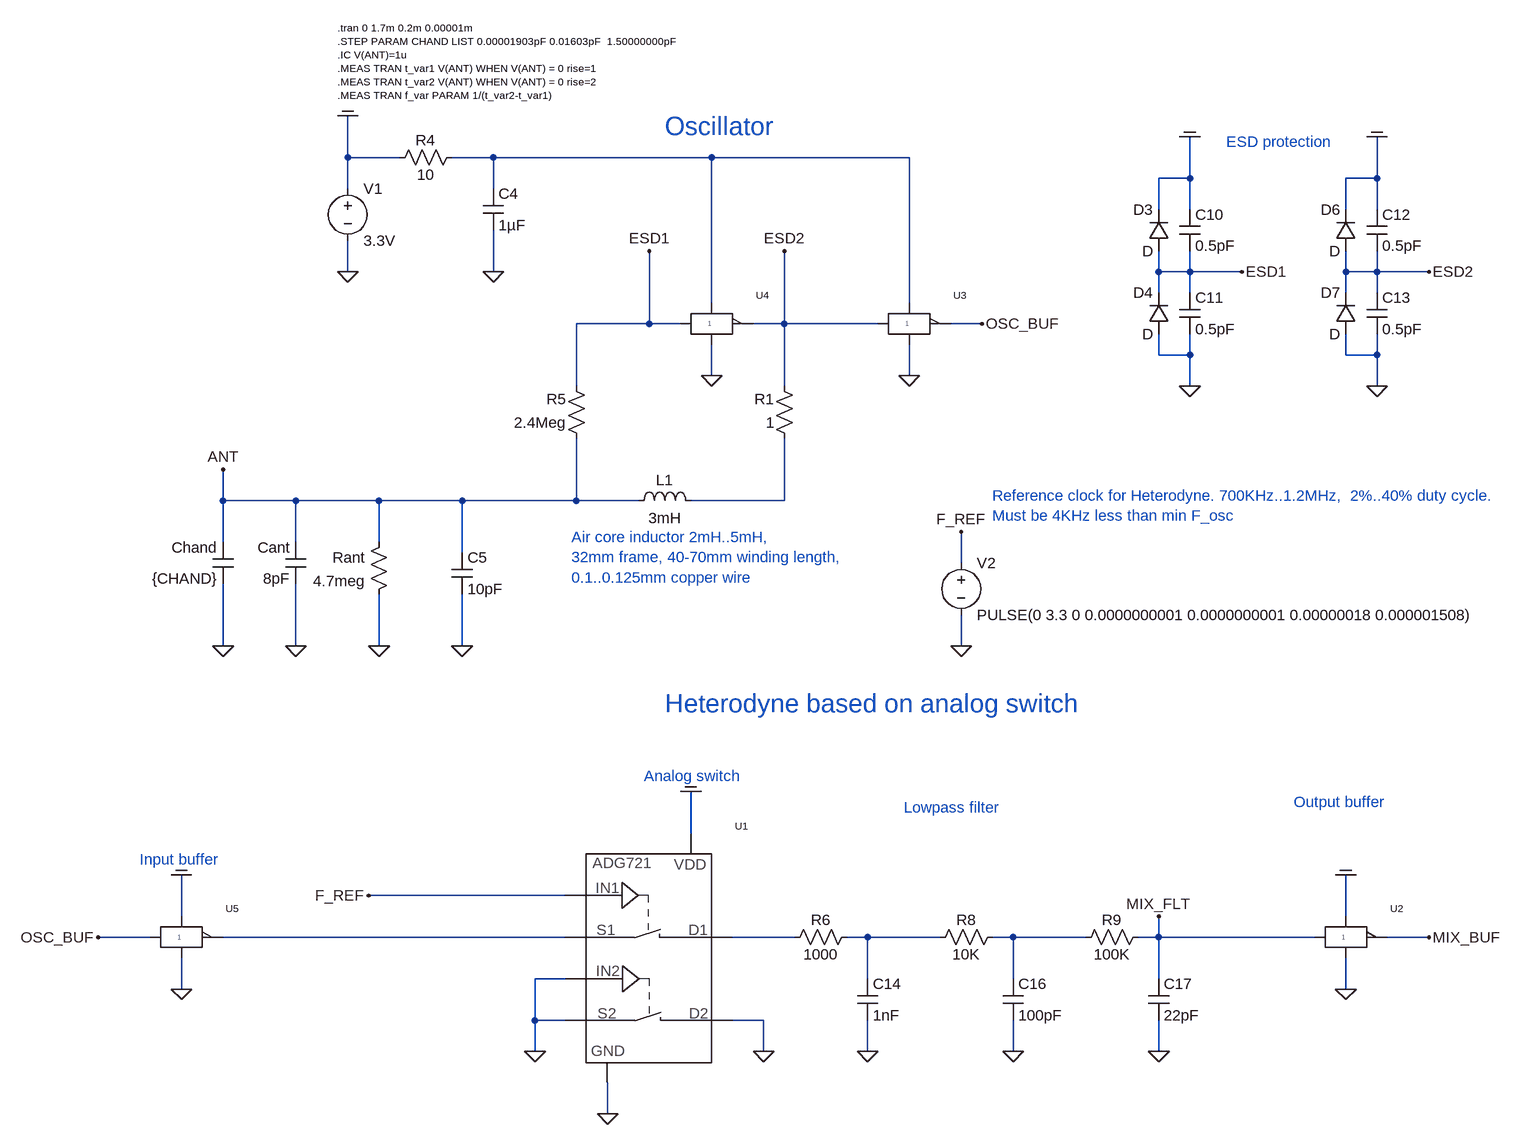
[diagram p0: schematic 2020_2g04_oscil_adg721_mixer_v1.asc]
2020_2g04_oscil_adg721_mixer_v1.asc, the LTspice schematic file:
Version 4
SHEET 1 2908 1588
WIRE -1056 -336 -1056 -400
WIRE -976 -336 -1056 -336
WIRE -832 -336 -896 -336
WIRE -496 -336 -832 -336
WIRE -192 -336 -496 -336
WIRE 240 -304 240 -368
WIRE 240 -304 192 -304
WIRE 528 -304 528 -368
WIRE 528 -304 480 -304
WIRE -1056 -288 -1056 -336
WIRE -832 -288 -832 -336
WIRE 192 -256 192 -304
WIRE 240 -256 240 -304
WIRE 480 -256 480 -304
WIRE 528 -256 528 -304
WIRE -1056 -160 -1056 -208
WIRE -832 -160 -832 -224
WIRE 192 -160 192 -192
WIRE 240 -160 240 -192
WIRE 240 -160 192 -160
WIRE 320 -160 240 -160
WIRE 480 -160 480 -192
WIRE 528 -160 528 -192
WIRE 528 -160 480 -160
WIRE 608 -160 528 -160
WIRE 192 -128 192 -160
WIRE 240 -128 240 -160
WIRE 480 -128 480 -160
WIRE 528 -128 528 -160
WIRE -496 -112 -496 -336
WIRE -192 -112 -192 -336
WIRE -592 -80 -592 -192
WIRE -592 -80 -704 -80
WIRE -544 -80 -592 -80
WIRE -384 -80 -384 -192
WIRE -384 -80 -432 -80
WIRE -240 -80 -384 -80
WIRE -80 -80 -128 -80
WIRE 192 -32 192 -64
WIRE 240 -32 240 -64
WIRE 240 -32 192 -32
WIRE 480 -32 480 -64
WIRE 528 -32 528 -64
WIRE 528 -32 480 -32
WIRE -496 0 -496 -48
WIRE -192 0 -192 -48
WIRE -704 16 -704 -80
WIRE -384 16 -384 -80
WIRE 240 16 240 -32
WIRE 528 16 528 -32
WIRE -1248 192 -1248 144
WIRE -1136 192 -1248 192
WIRE -1008 192 -1136 192
WIRE -880 192 -1008 192
WIRE -704 192 -704 96
WIRE -704 192 -880 192
WIRE -608 192 -704 192
WIRE -384 192 -384 96
WIRE -384 192 -528 192
WIRE -1248 256 -1248 192
WIRE -1136 256 -1136 192
WIRE -1008 256 -1008 192
WIRE -880 272 -880 192
WIRE -112 288 -112 240
WIRE -1248 416 -1248 320
WIRE -1136 416 -1136 320
WIRE -1008 416 -1008 336
WIRE -880 416 -880 336
WIRE -112 416 -112 368
WIRE -528 704 -528 640
WIRE -720 800 -1024 800
WIRE -1312 832 -1312 768
WIRE 480 832 480 768
WIRE -1360 864 -1440 864
WIRE -720 864 -1248 864
WIRE -368 864 -464 864
WIRE -256 864 -288 864
WIRE -144 864 -256 864
WIRE -32 864 -64 864
WIRE 80 864 -32 864
WIRE 192 864 192 832
WIRE 192 864 160 864
WIRE 432 864 192 864
WIRE 608 864 544 864
WIRE -720 928 -768 928
WIRE -256 928 -256 864
WIRE -32 928 -32 864
WIRE 192 928 192 864
WIRE -1312 944 -1312 896
WIRE 480 944 480 896
WIRE -768 992 -768 928
WIRE -720 992 -768 992
WIRE -416 992 -464 992
WIRE -768 1040 -768 992
WIRE -416 1040 -416 992
WIRE -256 1040 -256 992
WIRE -32 1040 -32 992
WIRE 192 1040 192 992
WIRE -656 1136 -656 1088
FLAG -1056 -160 0
FLAG -1248 416 0
FLAG -1248 144 ANT
FLAG -1008 416 0
FLAG -1056 -400 COM
FLAG 240 16 0
FLAG 240 -368 COM
FLAG 320 -160 ESD1
FLAG 528 16 0
FLAG 528 -368 COM
FLAG 608 -160 ESD2
FLAG -1136 416 0
FLAG -592 -192 ESD1
FLAG -80 -80 OSC_BUF
FLAG -832 -160 0
FLAG -384 -192 ESD2
FLAG -1440 864 OSC_BUF
FLAG -1024 800 F_REF
FLAG -528 640 COM
FLAG -768 1040 0
FLAG -256 1040 0
FLAG -32 1040 0
FLAG 192 1040 0
FLAG 192 832 MIX_FLT
FLAG -112 416 0
FLAG -112 240 F_REF
FLAG 480 768 COM
FLAG 480 944 0
FLAG 608 864 MIX_BUF
FLAG -192 0 0
FLAG -496 0 0
FLAG -1312 768 COM
FLAG -1312 944 0
FLAG -880 416 0
FLAG -656 1136 0
FLAG -416 1040 0
SYMBOL voltage -1056 -304 R0
WINDOW 123 0 0 Left 2
WINDOW 39 0 0 Left 2
SYMATTR InstName V1
SYMATTR Value 3.3V
SYMBOL ind -512 208 M270
WINDOW 0 32 56 VTop 2
WINDOW 3 5 56 VBottom 2
SYMATTR InstName L1
SYMATTR Value 3mH
SYMATTR SpiceLine Ipk=0.1 Rser=101 Rpar=2Meg Cpar=1.286pF
SYMBOL cap -1232 256 M0
SYMATTR InstName Chand
SYMATTR Value {CHAND}
SYMBOL res -992 240 M0
SYMATTR InstName Rant
SYMATTR Value 4.7meg
SYMBOL diode 208 -192 R180
WINDOW 0 24 64 Left 2
WINDOW 3 24 0 Left 2
SYMATTR InstName D3
SYMBOL diode 208 -64 R180
WINDOW 0 24 64 Left 2
WINDOW 3 24 0 Left 2
SYMATTR InstName D4
SYMBOL cap 224 -256 R0
SYMATTR InstName C10
SYMATTR Value 0.5pF
SYMBOL cap 224 -128 R0
SYMATTR InstName C11
SYMATTR Value 0.5pF
SYMBOL diode 496 -192 R180
WINDOW 0 24 64 Left 2
WINDOW 3 24 0 Left 2
SYMATTR InstName D6
SYMBOL diode 496 -64 R180
WINDOW 0 24 64 Left 2
WINDOW 3 24 0 Left 2
SYMATTR InstName D7
SYMBOL cap 512 -256 R0
SYMATTR InstName C12
SYMATTR Value 0.5pF
SYMBOL cap 512 -128 R0
SYMATTR InstName C13
SYMATTR Value 0.5pF
SYMBOL cap -1120 256 M0
SYMATTR InstName Cant
SYMATTR Value 8pF
SYMBOL res -880 -352 R90
WINDOW 0 5 56 VBottom 2
WINDOW 3 27 56 VTop 2
SYMATTR InstName R4
SYMATTR Value 10
SYMBOL cap -848 -288 R0
SYMATTR InstName C4
SYMATTR Value 1µF
SYMBOL cap -272 928 R0
SYMATTR InstName C14
SYMATTR Value 1nF
SYMBOL res -272 848 R90
WINDOW 0 5 56 VBottom 2
WINDOW 3 27 56 VTop 2
SYMATTR InstName R6
SYMATTR Value 1000
SYMBOL cap -48 928 R0
SYMATTR InstName C16
SYMATTR Value 100pF
SYMBOL res -48 848 R90
WINDOW 0 5 56 VBottom 2
WINDOW 3 27 56 VTop 2
SYMATTR InstName R8
SYMATTR Value 10K
SYMBOL cap 176 928 R0
SYMATTR InstName C17
SYMATTR Value 22pF
SYMBOL res 176 848 R90
WINDOW 0 5 56 VBottom 2
WINDOW 3 27 56 VTop 2
SYMATTR InstName R9
SYMATTR Value 100K
SYMBOL voltage -112 272 R0
WINDOW 123 0 0 Left 2
WINDOW 39 0 0 Left 2
SYMATTR InstName V2
SYMATTR Value PULSE(0 3.3 0 0.0000000001 0.0000000001 0.00000018 0.000001508)
SYMBOL 74AHC1G04 480 816 R0
SYMATTR InstName U2
SYMBOL 74AHC1G04 -192 -128 R0
SYMATTR InstName U3
SYMBOL 74AHC1G04 -496 -128 R0
SYMATTR InstName U4
SYMBOL res -688 112 R180
WINDOW 0 31 76 Left 2
WINDOW 3 31 40 Left 2
SYMATTR InstName R5
SYMATTR Value 2.4Meg
SYMBOL res -368 112 R180
WINDOW 0 31 76 Left 2
WINDOW 3 31 40 Left 2
SYMATTR InstName R1
SYMATTR Value 1
SYMBOL 74AHC1G04 -1312 816 R0
SYMATTR InstName U5
SYMBOL cap -896 272 R0
SYMATTR InstName C5
SYMATTR Value 10pF
SYMBOL ADG721 -656 896 R0
SYMATTR InstName U1
TEXT -1072 -536 Left 1 !.tran 0 1.7m 0.2m 0.00001m\n.STEP PARAM CHAND LIST 0.00001903pF 0.01603pF  1.50000000pF\n.IC V(ANT)=1u\n.MEAS TRAN t_var1 V(ANT) WHEN V(ANT) = 0 rise=1\n.MEAS TRAN t_var2 V(ANT) WHEN V(ANT) = 0 rise=2\n.MEAS TRAN f_var PARAM 1/(t_var2-t_var1)
TEXT 296 -360 Left 2 ;ESD protection
TEXT -200 664 Left 2 ;Lowpass filter
TEXT -568 504 Left 4 ;Heterodyne based on analog switch
TEXT -568 -384 Left 4 ;Oscillator
TEXT -1376 744 Left 2 ;Input buffer
TEXT -600 616 Left 2 ;Analog switch
TEXT 400 656 Left 2 ;Output buffer
TEXT -64 184 Left 2 ;Reference clock for Heterodyne. 700KHz..1.2MHz,  2%..40% duty cycle. \nMust be 4KHz less than min F_osc
TEXT -712 248 Left 2 ;Air core inductor 2mH..5mH, \n32mm frame, 40-70mm winding length, \n0.1..0.125mm copper wire

The netlist it stands for:
* 2020_2g04_oscil_adg721_mixer_v1.asc
V1 COM 0 3.3V
L1 N002 ANT 3mH Ipk=0.1 Rser=101 Rpar=2Meg Cpar=1.286pF
Chand ANT 0 {CHAND}
Rant ANT 0 4.7meg
D3 ESD1 COM D
D4 0 ESD1 D
C10 COM ESD1 0.5pF
C11 ESD1 0 0.5pF
D6 ESD2 COM D
D7 0 ESD2 D
C12 COM ESD2 0.5pF
C13 ESD2 0 0.5pF
Cant ANT 0 8pF
R4 N001 COM 10
C4 N001 0 1µF
C14 N005 0 1nF
R6 N005 N004 1000
C16 N006 0 100pF
R8 N006 N005 10K
C17 MIX_FLT 0 22pF
R9 MIX_FLT N006 100K
V2 F_REF 0 PULSE(0 3.3 0 0.0000000001 0.0000000001 0.00000018 0.000001508)
XU2 MIX_FLT MIX_BUF COM 0 74AHC1G04  ; pins in out vcc gnd
XU3 ESD2 OSC_BUF N001 0 74AHC1G04  ; pins in out vcc gnd
XU4 ESD1 ESD2 N001 0 74AHC1G04  ; pins in out vcc gnd
R5 ANT ESD1 2.4Meg
R1 N002 ESD2 1
XU5 OSC_BUF N003 COM 0 74AHC1G04  ; pins in out vcc gnd
C5 ANT 0 10pF
XU1 N003 N004 0 0 0 0 F_REF COM ADG721  ; pins S1 D1 IN2 GND S2 D2 IN1 VDD
.model D D
.lib standard.dio
.tran 0 1.7m 0.2m 0.00001m
.STEP PARAM CHAND LIST 0.00001903pF 0.01603pF  1.50000000pF
.IC V(ANT)=1u
.MEAS TRAN t_var1 V(ANT) WHEN V(ANT) = 0 rise=1
.MEAS TRAN t_var2 V(ANT) WHEN V(ANT) = 0 rise=2
.MEAS TRAN f_var PARAM 1/(t_var2-t_var1)
* ESD protection
* Lowpass filter
* Heterodyne based on analog switch
* Oscillator
* Input buffer
* Analog switch
* Output buffer
* Reference clock for Heterodyne. 700KHz..1.2MHz,  2%..40% duty cycle.
* Must be 4KHz less than min F_osc
* Air core inductor 2mH..5mH,
* 32mm frame, 40-70mm winding length,
* 0.1..0.125mm copper wire
.lib 74AHC1G04.cir
.lib adg721.cir
.backanno
.end